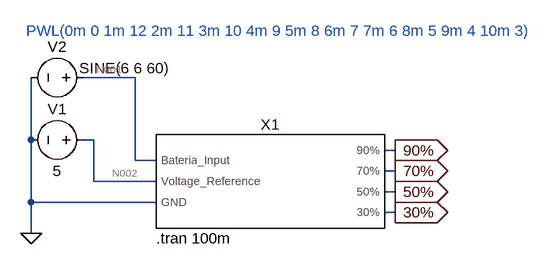
[diagram p0: schematic main.asc]
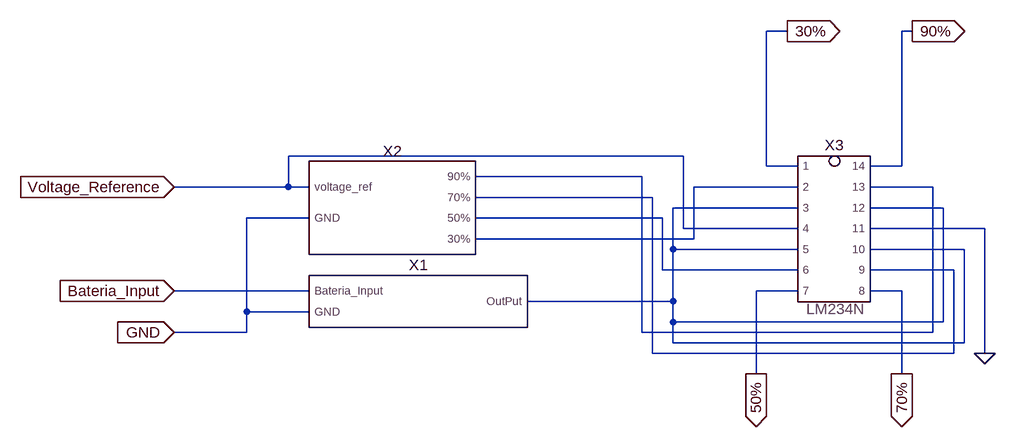
[diagram p1: sub-circuit modulo_bateria.asc]
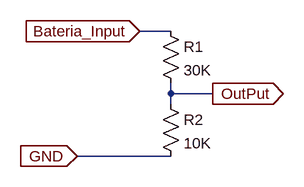
[diagram p2: sub-circuit dividor_bateria.asc]
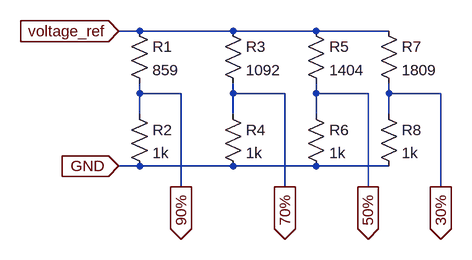
[diagram p3: sub-circuit referencia.asc]
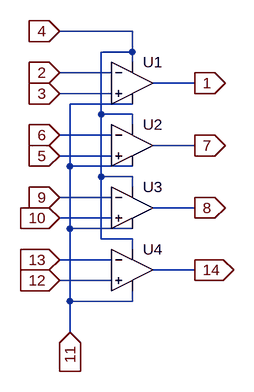
[diagram p4: sub-circuit comparador.asc]
main.asc, the LTspice schematic file:
Version 4
SHEET 1 1108 680
WIRE 144 -16 64 -16
WIRE -16 80 -16 -16
WIRE 80 80 64 80
WIRE 544 96 528 96
WIRE 144 112 144 -16
WIRE 176 112 144 112
WIRE 544 128 528 128
WIRE 80 144 80 80
WIRE 176 144 80 144
WIRE 544 160 528 160
WIRE -16 176 -16 80
WIRE 176 176 -16 176
WIRE 544 192 528 192
WIRE -16 224 -16 176
FLAG -16 224 0
FLAG 544 192 30%
IOPIN 544 192 Out
FLAG 544 160 50%
IOPIN 544 160 Out
FLAG 544 128 70%
IOPIN 544 128 Out
FLAG 544 96 90%
IOPIN 544 96 Out
SYMBOL Modulo_bateria 352 144 R0
SYMATTR InstName X1
SYMBOL voltage 80 80 R90
WINDOW 0 -32 56 VBottom 2
WINDOW 3 32 56 VTop 2
WINDOW 123 0 0 Left 2
WINDOW 39 0 0 Left 2
SYMATTR InstName V1
SYMATTR Value 5
SYMBOL voltage 80 -16 R90
WINDOW 0 -32 56 VBottom 2
WINDOW 3 -30 -48 VTop 2
WINDOW 123 0 0 Left 2
WINDOW 39 0 0 Left 2
SYMATTR InstName V2
SYMATTR Value SINE(6 6 60)
TEXT 176 232 Left 2 !.tran 100m
TEXT -24 -88 Left 2 ;PWL(0m 0 1m 12 2m 11 3m 10 4m 9 5m 8 6m 7 7m 6 8m 5 9m 4 10m 3)

modulo_bateria.asc, the sub-circuit schematic file:
Version 4
SHEET 1 1048 680
WIRE 560 -176 528 -176
WIRE 752 -176 736 -176
WIRE 400 16 -208 16
WIRE 528 32 528 -176
WIRE 576 32 528 32
WIRE 736 32 736 -176
WIRE 736 32 688 32
WIRE 336 48 80 48
WIRE -208 64 -208 16
WIRE -208 64 -384 64
WIRE -176 64 -208 64
WIRE 576 64 416 64
WIRE 784 64 688 64
WIRE 352 80 80 80
WIRE 576 96 384 96
WIRE 800 96 688 96
WIRE -176 112 -272 112
WIRE 368 112 80 112
WIRE 400 128 400 16
WIRE 576 128 400 128
WIRE 864 128 688 128
WIRE 416 144 416 64
WIRE 416 144 80 144
WIRE 384 160 384 96
WIRE 576 160 384 160
WIRE 832 160 688 160
WIRE 368 192 368 112
WIRE 576 192 368 192
WIRE 816 192 688 192
WIRE -176 224 -384 224
WIRE 576 224 512 224
WIRE 736 224 688 224
WIRE 384 240 384 160
WIRE 384 240 160 240
WIRE -272 256 -272 112
WIRE -176 256 -272 256
WIRE 384 272 384 240
WIRE 800 272 800 96
WIRE 800 272 384 272
WIRE -272 288 -272 256
WIRE -272 288 -384 288
WIRE 336 288 336 48
WIRE 784 288 784 64
WIRE 784 288 336 288
WIRE 384 304 384 272
WIRE 832 304 832 160
WIRE 832 304 384 304
WIRE 352 320 352 80
WIRE 816 320 816 192
WIRE 816 320 352 320
WIRE 864 320 864 128
WIRE 512 352 512 224
WIRE 736 352 736 224
FLAG 864 320 0
FLAG 560 -176 30%
IOPIN 560 -176 Out
FLAG 512 352 50%
IOPIN 512 352 Out
FLAG 752 -176 90%
IOPIN 752 -176 Out
FLAG 736 352 70%
IOPIN 736 352 Out
FLAG -384 64 Voltage_Reference
IOPIN -384 64 In
FLAG -384 224 Bateria_Input
IOPIN -384 224 In
FLAG -384 288 GND
IOPIN -384 288 In
DATAFLAG 192 48 ""
DATAFLAG 192 80 ""
DATAFLAG 192 112 ""
DATAFLAG 192 144 ""
DATAFLAG 240 240 ""
DATAFLAG -272 64 ""
DATAFLAG -240 224 ""
DATAFLAG -288 288 ""
DATAFLAG 528 -64 ""
DATAFLAG 528 224 ""
DATAFLAG 720 224 ""
DATAFLAG 736 -80 ""
SYMBOL Dividor_Bateria -16 240 R0
SYMATTR InstName X1
SYMBOL Referencia -48 96 R0
SYMATTR InstName X2
SYMBOL Comparador 656 176 R0
SYMATTR InstName X3

dividor_bateria.asc, the sub-circuit schematic file:
Version 4
SHEET 1 880 680
WIRE 80 80 32 80
WIRE 80 176 80 160
WIRE 144 176 80 176
WIRE 80 192 80 176
WIRE 80 272 -64 272
FLAG 32 80 Bateria_Input
IOPIN 32 80 In
FLAG -64 272 GND
IOPIN -64 272 In
FLAG 144 176 OutPut
IOPIN 144 176 Out
SYMBOL res 64 64 R0
SYMATTR InstName R1
SYMATTR Value 30K
SYMBOL res 64 176 R0
SYMATTR InstName R2
SYMATTR Value 10K

referencia.asc, the sub-circuit schematic file:
Version 4
SHEET 1 880 680
WIRE 112 64 80 64
WIRE 256 64 112 64
WIRE 384 64 256 64
WIRE 496 64 384 64
WIRE 112 160 112 144
WIRE 176 160 112 160
WIRE 256 160 256 144
WIRE 336 160 256 160
WIRE 384 160 384 144
WIRE 464 160 384 160
WIRE 496 160 496 144
WIRE 576 160 496 160
WIRE 112 192 112 160
WIRE 256 192 256 160
WIRE 384 192 384 160
WIRE 496 192 496 160
WIRE 112 272 80 272
WIRE 256 272 112 272
WIRE 384 272 256 272
WIRE 496 272 384 272
WIRE 176 304 176 160
WIRE 336 304 336 160
WIRE 464 304 464 160
WIRE 576 304 576 160
FLAG 80 64 voltage_ref
IOPIN 80 64 In
FLAG 80 272 GND
IOPIN 80 272 In
FLAG 576 304 30%
IOPIN 576 304 Out
FLAG 464 304 50%
IOPIN 464 304 Out
FLAG 336 304 70%
IOPIN 336 304 Out
FLAG 176 304 90%
IOPIN 176 304 Out
SYMBOL res 96 48 R0
SYMATTR InstName R1
SYMATTR Value 859
SYMBOL res 96 176 R0
SYMATTR InstName R2
SYMATTR Value 1k
SYMBOL res 240 48 R0
SYMATTR InstName R3
SYMATTR Value 1092
SYMBOL res 240 176 R0
SYMATTR InstName R4
SYMATTR Value 1k
SYMBOL res 368 48 R0
SYMATTR InstName R5
SYMATTR Value 1404
SYMBOL res 368 176 R0
SYMATTR InstName R6
SYMATTR Value 1k
SYMBOL res 480 48 R0
SYMATTR InstName R7
SYMATTR Value 1809
SYMBOL res 480 176 R0
SYMATTR InstName R8
SYMATTR Value 1k

comparador.asc, the sub-circuit schematic file:
Version 4
SHEET 1 880 680
WIRE 96 0 -16 0
WIRE 96 32 96 0
WIRE 96 32 48 32
WIRE 96 48 96 32
WIRE 64 64 -16 64
WIRE 192 80 128 80
WIRE 64 96 -16 96
WIRE 96 112 0 112
WIRE 48 128 48 32
WIRE 96 128 48 128
WIRE 96 144 96 128
WIRE 64 160 -16 160
WIRE 192 176 128 176
WIRE 64 192 -16 192
WIRE 0 208 0 112
WIRE 96 208 0 208
WIRE 48 224 48 128
WIRE 96 224 48 224
WIRE 96 240 96 224
WIRE 64 256 -16 256
WIRE 192 272 128 272
WIRE 64 288 -16 288
WIRE 0 304 0 208
WIRE 96 304 0 304
WIRE 48 320 48 224
WIRE 96 320 48 320
WIRE 96 336 96 320
WIRE 64 352 -16 352
WIRE 192 368 128 368
WIRE 64 384 -16 384
WIRE 0 416 0 304
WIRE 96 416 96 400
WIRE 96 416 0 416
WIRE 0 464 0 416
FLAG 192 80 1
IOPIN 192 80 Out
FLAG 192 176 7
IOPIN 192 176 Out
FLAG 192 272 8
IOPIN 192 272 Out
FLAG 192 368 14
IOPIN 192 368 Out
FLAG -16 96 3
IOPIN -16 96 In
FLAG -16 64 2
IOPIN -16 64 In
FLAG -16 160 6
IOPIN -16 160 In
FLAG -16 192 5
IOPIN -16 192 In
FLAG -16 256 9
IOPIN -16 256 In
FLAG -16 288 10
IOPIN -16 288 In
FLAG -16 352 13
IOPIN -16 352 In
FLAG -16 384 12
IOPIN -16 384 In
FLAG -16 0 4
IOPIN -16 0 In
FLAG 0 464 11
IOPIN 0 464 In
SYMBOL Opamps\\UniversalOpamp2 96 80 R0
SYMATTR InstName U1
SYMBOL Opamps\\UniversalOpamp2 96 176 R0
SYMATTR InstName U2
SYMBOL Opamps\\UniversalOpamp2 96 272 R0
SYMATTR InstName U3
SYMBOL Opamps\\UniversalOpamp2 96 368 R0
SYMATTR InstName U4

The netlist it stands for:
* main.asc
XX1 N001 0 N002 30% 50% 70% 90% modulo_bateria
V1 N002 0 5
V2 N001 0 SINE(6 6 60)

* block symbol definitions
.subckt modulo_bateria Bateria_Input GND Voltage_Reference 30% 50% 70% 90%
XX1 Bateria_Input GND N004 dividor_bateria
XX2 GND Voltage_Reference N002 N005 N003 N001 referencia
XX3 N004 N004 N001 N002 N004 Voltage_Reference N004 N005 N003 0 30% 90% 50% 70% comparador
.ends modulo_bateria

.subckt dividor_bateria Bateria_Input GND OutPut
R1 Bateria_Input OutPut 30K
R2 OutPut GND 10K
.ends dividor_bateria

.subckt referencia GND voltage_ref 30% 50% 70% 90%
R1 voltage_ref 90% 859
R2 90% GND 1k
R3 voltage_ref 70% 1092
R4 70% GND 1k
R5 voltage_ref 50% 1404
R6 50% GND 1k
R7 voltage_ref 30% 1809
R8 30% GND 1k
.ends referencia

.subckt comparador 10 12 13 2 3 4 5 6 9 11 1 14 7 8
XU1 3 2 4 11 1 level.2 Avol=1Meg GBW=10Meg Slew=10Meg ilimit=25m rail=0 Vos=0 phimargin=45 en=0 enk=0 in=0 ink=0 Rin=500Meg  ; pins IN+ IN- V+ V- OUT
XU2 5 6 4 11 7 level.2 Avol=1Meg GBW=10Meg Slew=10Meg ilimit=25m rail=0 Vos=0 phimargin=45 en=0 enk=0 in=0 ink=0 Rin=500Meg  ; pins IN+ IN- V+ V- OUT
XU3 10 9 4 11 8 level.2 Avol=1Meg GBW=10Meg Slew=10Meg ilimit=25m rail=0 Vos=0 phimargin=45 en=0 enk=0 in=0 ink=0 Rin=500Meg  ; pins IN+ IN- V+ V- OUT
XU4 12 13 4 11 14 level.2 Avol=1Meg GBW=10Meg Slew=10Meg ilimit=25m rail=0 Vos=0 phimargin=45 en=0 enk=0 in=0 ink=0 Rin=500Meg  ; pins IN+ IN- V+ V- OUT
.ends comparador

.tran 100m
* PWL(0m 0 1m 12 2m 11 3m 10 4m 9 5m 8 6m 7 7m 6 8m 5 9m 4 10m 3)
.lib UniversalOpamps2.sub
.backanno
.end

* Results of the author's LTspice run, read from the files saved beside the schematic
* Operating Point, zero values left out:
*   V(n001) = 6 V
*   V(n002) = 5 V
*   V(30%) = 6.026 µV
*   V(50%) = 5.963 µV
*   V(70%) = 5.962 µV
*   V(90%) = 5.962 µV
*   I(V2) = -150 µA
*   I(V1) = -8.942 mA
*   Ix(x1:BATERIA_INPUT) = 150 µA
*   Ix(x1:GND) = -9.09 mA
*   Ix(x1:VOLTAGE_REFERENCE) = 8.942 mA
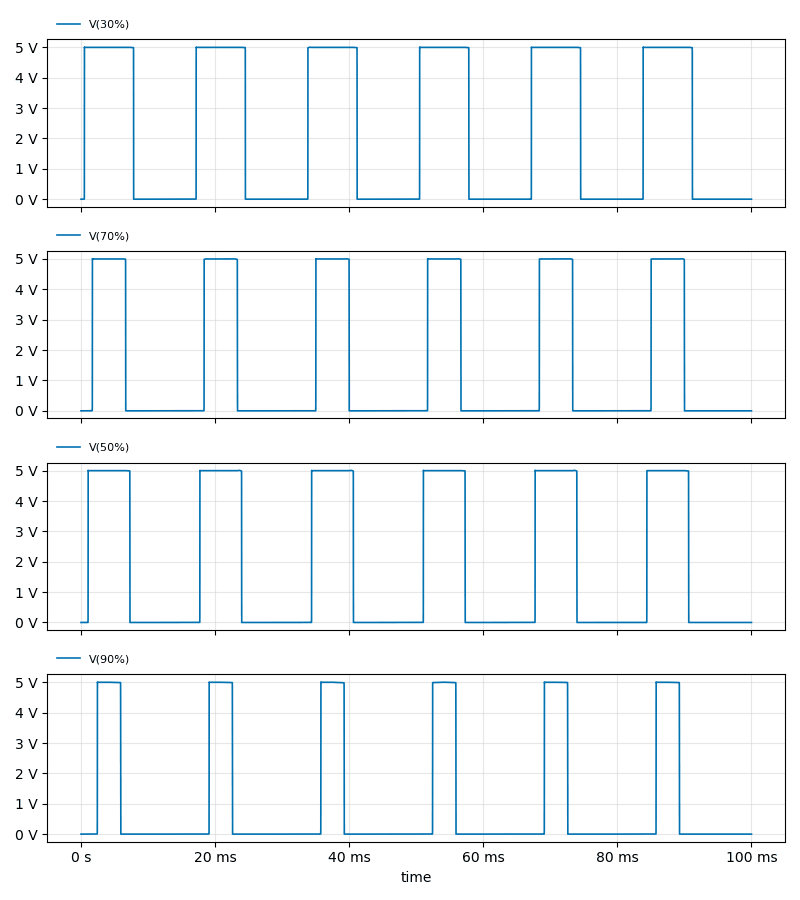
[diagram p5: Transient Analysis of main.asc, plotted from the saved traces]
* Transient Analysis, 1 run:
*   V(30%): min -2.903 µV, max 5.011 V, average 2.201 V, rms 3.316 V, last 6.015 µV
*   V(70%): min -100.4 µV, max 5.009 V, average 1.489 V, rms 2.727 V, last 5.962 µV
*   V(50%): min -16.11 µV, max 5.01 V, average 1.868 V, rms 3.055 V, last 5.963 µV
*   V(90%): min -154 µV, max 5.011 V, average 1.042 V, rms 2.28 V, last 5.962 µV